# Altium schematic sheet 01-MYB-Y6ULX.SchDoc
size A3
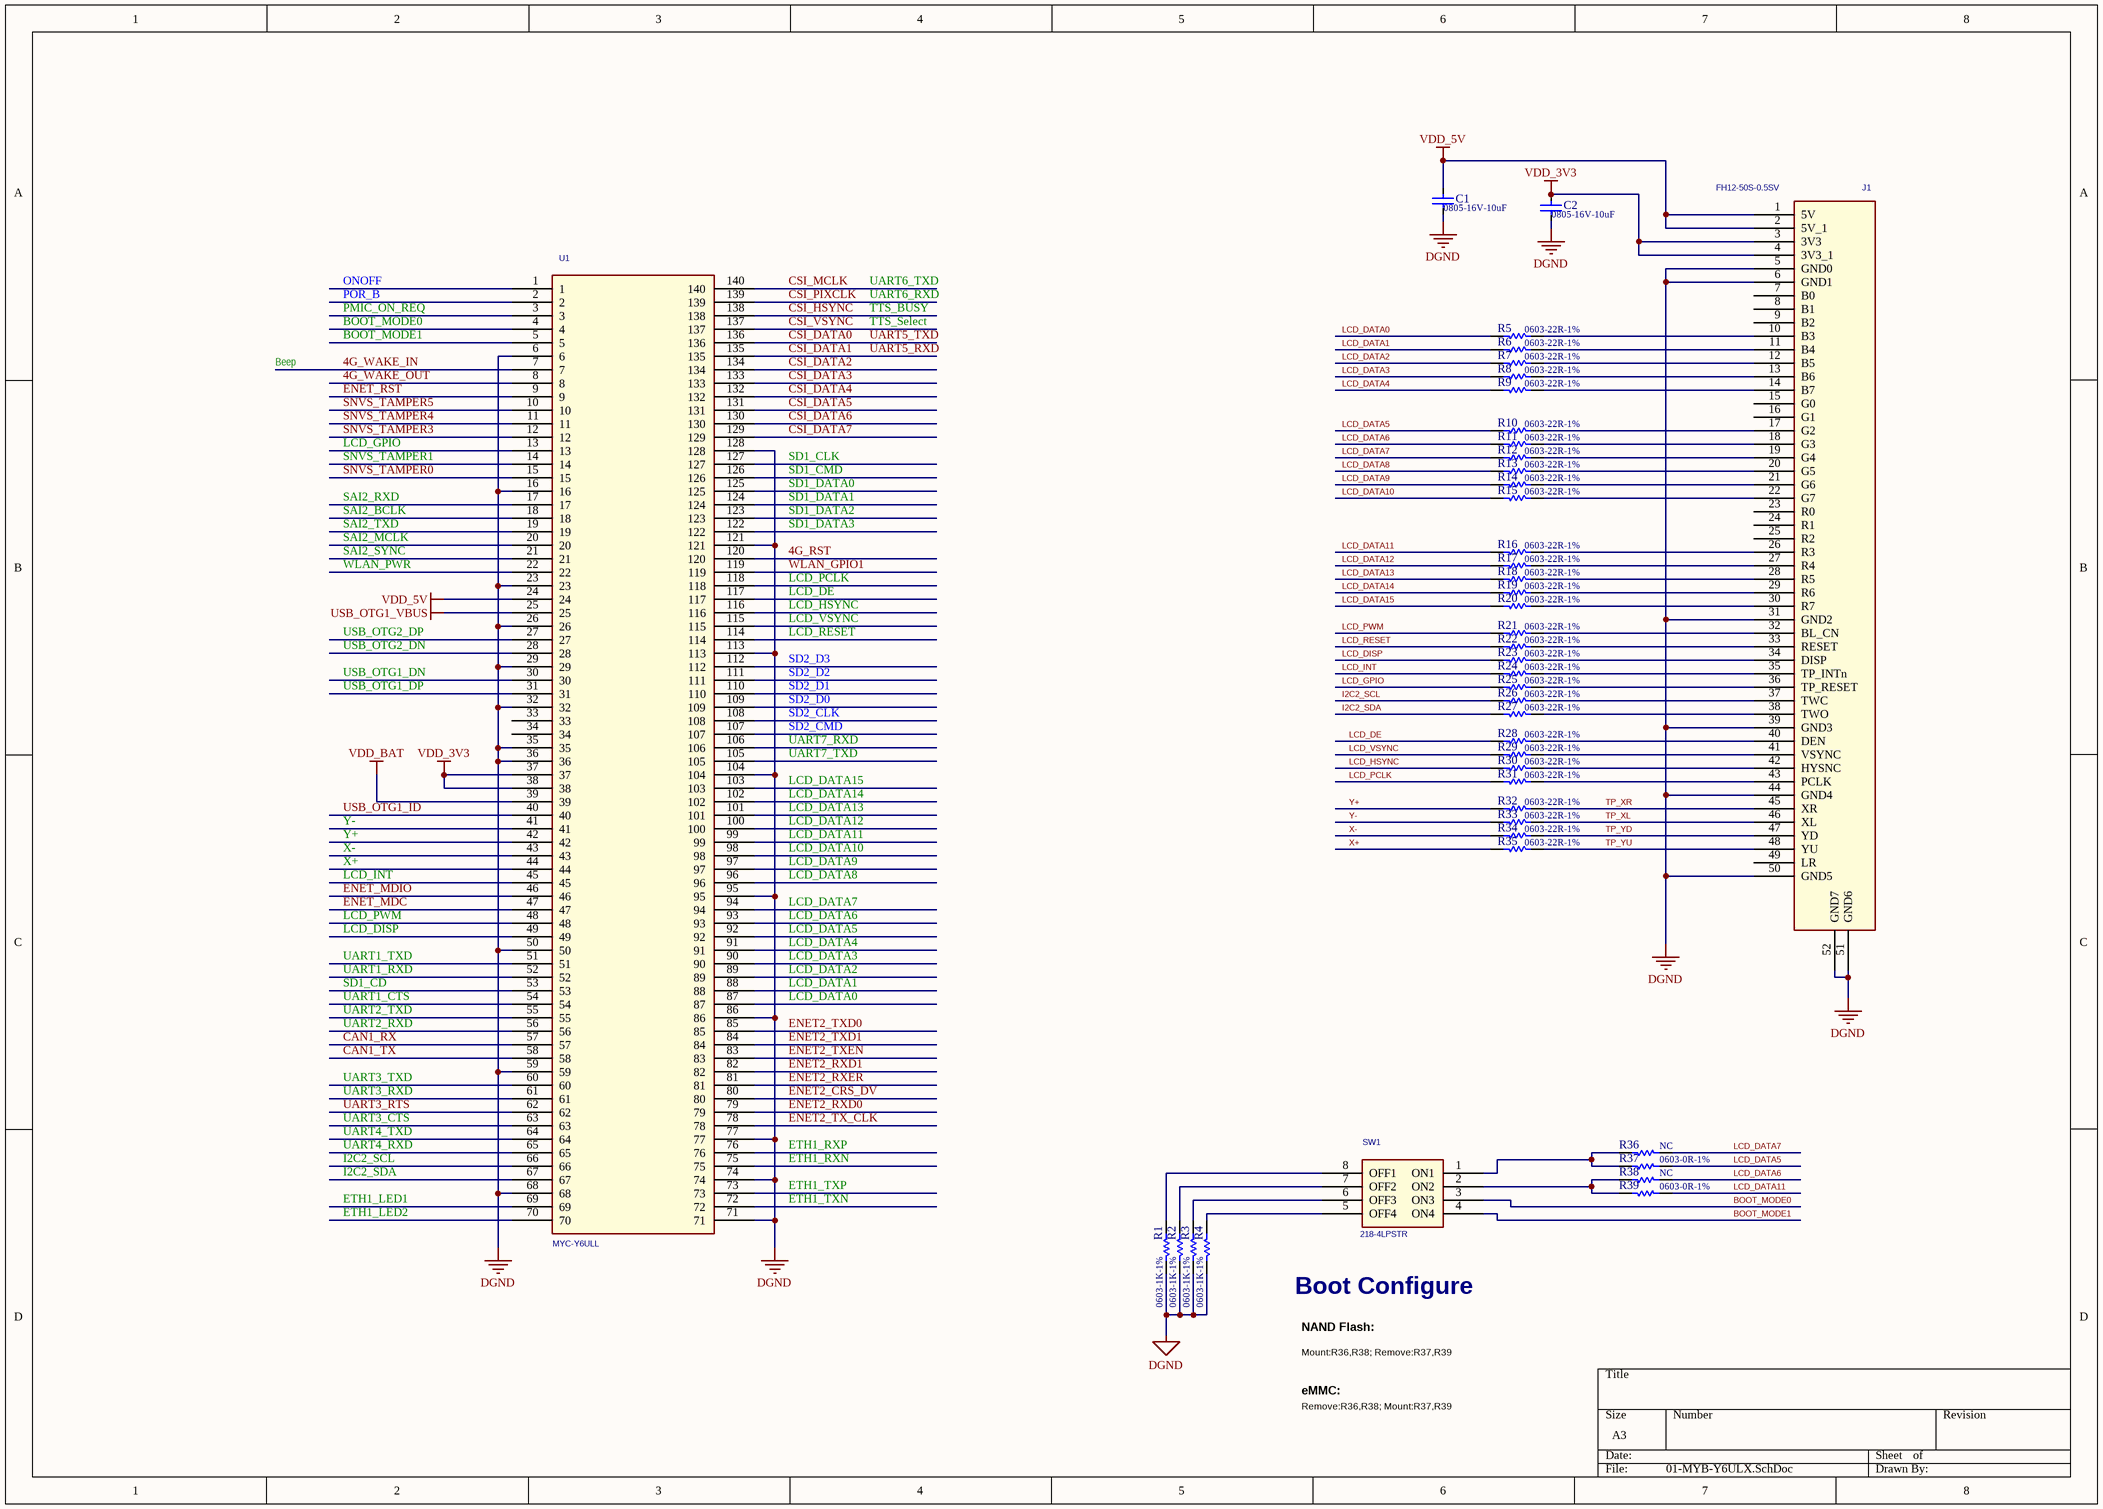
[diagram p0: 01-MYB-Y6ULX.SchDoc]

## Parts
C1  0805-16V-10uF  [0805C - 3D]
C2  0805-16V-10uF  [0805C - 3D]
J1  FH12-50S-0.5SV  [fpc50-1_0-v]
R1  0603-1K-1%  [0603R]
R2  0603-1K-1%  [0603R]
R3  0603-1K-1%  [0603R]
R4  0603-1K-1%  [0603R]
R5  0603-22R-1%  [0603R]
R6  0603-22R-1%  [0603R]
R7  0603-22R-1%  [0603R]
R8  0603-22R-1%  [0603R]
R9  0603-22R-1%  [0603R]
R10  0603-22R-1%  [0603R]
R11  0603-22R-1%  [0603R]
R12  0603-22R-1%  [0603R]
R13  0603-22R-1%  [0603R]
R14  0603-22R-1%  [0603R]
R15  0603-22R-1%  [0603R]
R16  0603-22R-1%  [0603R]
R17  0603-22R-1%  [0603R]
R18  0603-22R-1%  [0603R]
R19  0603-22R-1%  [0603R]
R20  0603-22R-1%  [0603R]
R21  0603-22R-1%  [0603R]
R22  0603-22R-1%  [0603R]
R23  0603-22R-1%  [0603R]
R24  0603-22R-1%  [0603R]
R25  0603-22R-1%  [0603R]
R26  0603-22R-1%  [0603R]
R27  0603-22R-1%  [0603R]
R28  0603-22R-1%  [0603R]
R29  0603-22R-1%  [0603R]
R30  0603-22R-1%  [0603R]
R31  0603-22R-1%  [0603R]
R32  0603-22R-1%  [0603R]
R33  0603-22R-1%  [0603R]
R34  0603-22R-1%  [0603R]
R35  0603-22R-1%  [0603R]
R36  NC  [0603R]
R37  0603-0R-1%  [0603R]
R38  NC  [0603R]
R39  0603-0R-1%  [0603R]
SW1  218-4LPSTR  [sw-1x4]
U1  MYC-Y6ULL  [YOUPK37X39_1_00-SMD]

## Nets
DGND: C1.2 C2.2 J1.5(GND0) J1.6(GND1) J1.31(GND2) J1.39(GND3) J1.44(GND4) J1.50(GND5) J1.51(GND6) J1.52(GND7) R1.1 R2.1 R3.1 R4.1 U1.6 U1.16 U1.23 U1.26 U1.29 U1.32 U1.35 U1.36 U1.50 U1.59 U1.68 U1.71 U1.74 U1.77 U1.86 U1.95 U1.104 U1.113 U1.121 U1.128
USB_OTG1_VBUS: U1.25
VDD_3V3: C2.1 J1.3(3V3) J1.4(3V3_1) U1.37 U1.38
VDD_5V: C1.1 J1.1(5V) J1.2(5V_1) U1.24
VDD_BAT: U1.39
4G_RST: U1.120
4G_WAKE_IN: U1.7  [also labelled Beep]
4G_WAKE_OUT: U1.8
BOOT_MODE0: SW1.3(ON3) U1.4
BOOT_MODE1: SW1.4(ON4) U1.5
CAN1_RX: U1.57
CAN1_TX: U1.58
CSI_DATA0: U1.136  [also labelled UART5_TXD]
CSI_DATA1: U1.135  [also labelled UART5_RXD]
CSI_DATA2: U1.134
CSI_DATA3: U1.133
CSI_DATA4: U1.132
CSI_DATA5: U1.131
CSI_DATA6: U1.130
CSI_DATA7: U1.129
CSI_HSYNC: U1.138  [also labelled TTS_BUSY]
CSI_MCLK: U1.140  [also labelled UART6_TXD]
CSI_PIXCLK: U1.139  [also labelled UART6_RXD]
CSI_VSYNC: U1.137  [also labelled TTS_Select]
ENET2_CRS_DV: U1.80
ENET2_RXD0: U1.79
ENET2_RXD1: U1.82
ENET2_RXER: U1.81
ENET2_TX_CLK: U1.78
ENET2_TXD0: U1.85
ENET2_TXD1: U1.84
ENET2_TXEN: U1.83
ENET_MDC: U1.47
ENET_MDIO: U1.46
ENET_RST: U1.9
ETH1_LED1: U1.69
ETH1_LED2: U1.70
ETH1_RXN: U1.75
ETH1_RXP: U1.76
ETH1_TXN: U1.72
ETH1_TXP: U1.73
I2C2_SCL: R26.1 U1.66
I2C2_SDA: R27.1 U1.67
LCD_DATA0: R5.1 U1.87
LCD_DATA1: R6.1 U1.88
LCD_DATA2: R7.1 U1.89
LCD_DATA3: R8.1 U1.90
LCD_DATA4: R9.1 U1.91
LCD_DATA5: R10.1 R37.2 U1.92
LCD_DATA6: R11.1 R38.2 U1.93
LCD_DATA7: R12.1 R36.2 U1.94
LCD_DATA8: R13.1 U1.96
LCD_DATA9: R14.1 U1.97
LCD_DATA10: R15.1 U1.98
LCD_DATA11: R16.1 R39.2 U1.99
LCD_DATA12: R17.1 U1.100
LCD_DATA13: R18.1 U1.101
LCD_DATA14: R19.1 U1.102
LCD_DATA15: R20.1 U1.103
LCD_DE: R28.1 U1.117
LCD_DISP: R23.1 U1.49
LCD_GPIO: R25.1 U1.13
LCD_HSYNC: R30.1 U1.116
LCD_INT: R24.1 U1.45
LCD_PCLK: R31.1 U1.118
LCD_PWM: R21.1 U1.48
LCD_RESET: R22.1 U1.114
LCD_VSYNC: R29.1 U1.115
ONOFF: U1.1
PMIC_ON_REQ: U1.3
POR_B: U1.2
SAI2_BCLK: U1.18
SAI2_MCLK: U1.20
SAI2_RXD: U1.17
SAI2_SYNC: U1.21
SAI2_TXD: U1.19
SD1_CD: U1.53
SD1_CLK: U1.127
SD1_CMD: U1.126
SD1_DATA0: U1.125
SD1_DATA1: U1.124
SD1_DATA2: U1.123
SD1_DATA3: U1.122
SD2_CLK: U1.108
SD2_CMD: U1.107
SD2_D0: U1.109
SD2_D1: U1.110
SD2_D2: U1.111
SD2_D3: U1.112
SNVS_TAMPER0: U1.15
SNVS_TAMPER1: U1.14
SNVS_TAMPER3: U1.12
SNVS_TAMPER4: U1.11
SNVS_TAMPER5: U1.10
TP_XL: J1.46(XL) R33.2
TP_XR: J1.45(XR) R32.2
TP_YD: J1.47(YD) R34.2
TP_YU: J1.48(YU) R35.2
UART1_CTS: U1.54
UART1_RXD: U1.52
UART1_TXD: U1.51
UART2_RXD: U1.56
UART2_TXD: U1.55
UART3_CTS: U1.63
UART3_RTS: U1.62
UART3_RXD: U1.61
UART3_TXD: U1.60
UART4_RXD: U1.65
UART4_TXD: U1.64
UART7_RXD: U1.106
UART7_TXD: U1.105
USB_OTG1_DN: U1.30
USB_OTG1_DP: U1.31
USB_OTG1_ID: U1.40
USB_OTG2_DN: U1.28
USB_OTG2_DP: U1.27
WLAN_GPIO1: U1.119
WLAN_PWR: U1.22
X+: R35.1 U1.44
X-: R34.1 U1.43
Y+: R32.1 U1.42
Y-: R33.1 U1.41
NetJ1_10: J1.10(B3) R5.2
NetJ1_11: J1.11(B4) R6.2
NetJ1_12: J1.12(B5) R7.2
NetJ1_13: J1.13(B6) R8.2
NetJ1_14: J1.14(B7) R9.2
NetJ1_17: J1.17(G2) R10.2
NetJ1_18: J1.18(G3) R11.2
NetJ1_19: J1.19(G4) R12.2
NetJ1_20: J1.20(G5) R13.2
NetJ1_21: J1.21(G6) R14.2
NetJ1_22: J1.22(G7) R15.2
NetJ1_26: J1.26(R3) R16.2
NetJ1_27: J1.27(R4) R17.2
NetJ1_28: J1.28(R5) R18.2
NetJ1_29: J1.29(R6) R19.2
NetJ1_30: J1.30(R7) R20.2
NetJ1_32: J1.32(BL_CN) R21.2
NetJ1_33: J1.33(RESET) R22.2
NetJ1_34: J1.34(DISP) R23.2
NetJ1_35: J1.35(TP_INTn) R24.2
NetJ1_36: J1.36(TP_RESET) R25.2
NetJ1_37: J1.37(TWC) R26.2
NetJ1_38: J1.38(TWO) R27.2
NetJ1_40: J1.40(DEN) R28.2
NetJ1_41: J1.41(VSYNC) R29.2
NetJ1_42: J1.42(HYSNC) R30.2
NetJ1_43: J1.43(PCLK) R31.2
NetR1_2: R1.2 SW1.8(OFF1)
NetR2_2: R2.2 SW1.7(OFF2)
NetR3_2: R3.2 SW1.6(OFF3)
NetR4_2: R4.2 SW1.5(OFF4)
NetR36_1: R36.1 R37.1 SW1.1(ON1)
NetR38_1: R38.1 R39.1 SW1.2(ON2)

Not connected (* = marked no-connect by the designer): J1 7(B0) 8(B1) 9(B2) 15(G0) 16(G1) 23(R0) 24(R1) 25(R2) 49(LR); U1 33 34

## Notes on the sheet
- Boot Configure
- eMMC:
- NAND Flash:
- Mount:R36,R38; Remove:R37,R39
- Remove:R36,R38; Mount:R37,R39

## Library data of the parts
C1 C2 = Cap: Capacitor; Value: 10nF; Published: 8-Jun-2000; Revision: July-2002: Re-released for DXP Platform.; Publisher: Altium Limited
J1 = FPC50: FPC Connector,Straight,50Pin,0.5mm Pitch  Flip Vertical  Type ,2MM Height,Tin Plated, white,SMD; Manufacturer: HRS; Myir P/N: 2110600006; Datasheet: FH12_30s-fpc.pdf; Reserve Value: FH12-50S-0.5SV; Manufacturer P/N: FH12-50S-0.5SV; Part Type: Connector
R1-R35 R37 R39 = Res1: Resistor; Value: 1K; Published: 8-Jun-2000; LatestRevisionDate: 17-Jul-2002; LatestRevisionNote: Re-released for DXP Platform.; PackageReference: AXIAL-0.3; Publisher: Altium Limited
R36 R38 = Res1: Resistor; Value: 0603-0R-1%; Published: 8-Jun-2000; LatestRevisionDate: 17-Jul-2002; LatestRevisionNote: Re-released for DXP Platform.; PackageReference: AXIAL-0.3; Publisher: Altium Limited
SW1 = SWITCH-4: Switch, Dip Switches SPST 4 switch sections,4 Position,1.27MM Pitch,black housing,white plunger,SMD,CTS; Myir P/N: 2120300002; Datasheet: 218-786217.pdf; Reserve Value: 218-4LPSTR; Manufacturer P/N: 218-4LPSTR; Manufacturer: CTS; Part Type: Switch
U1 = AM335X_QFN_2